# EAGLE design W501X (EAGLE 6.6.0)
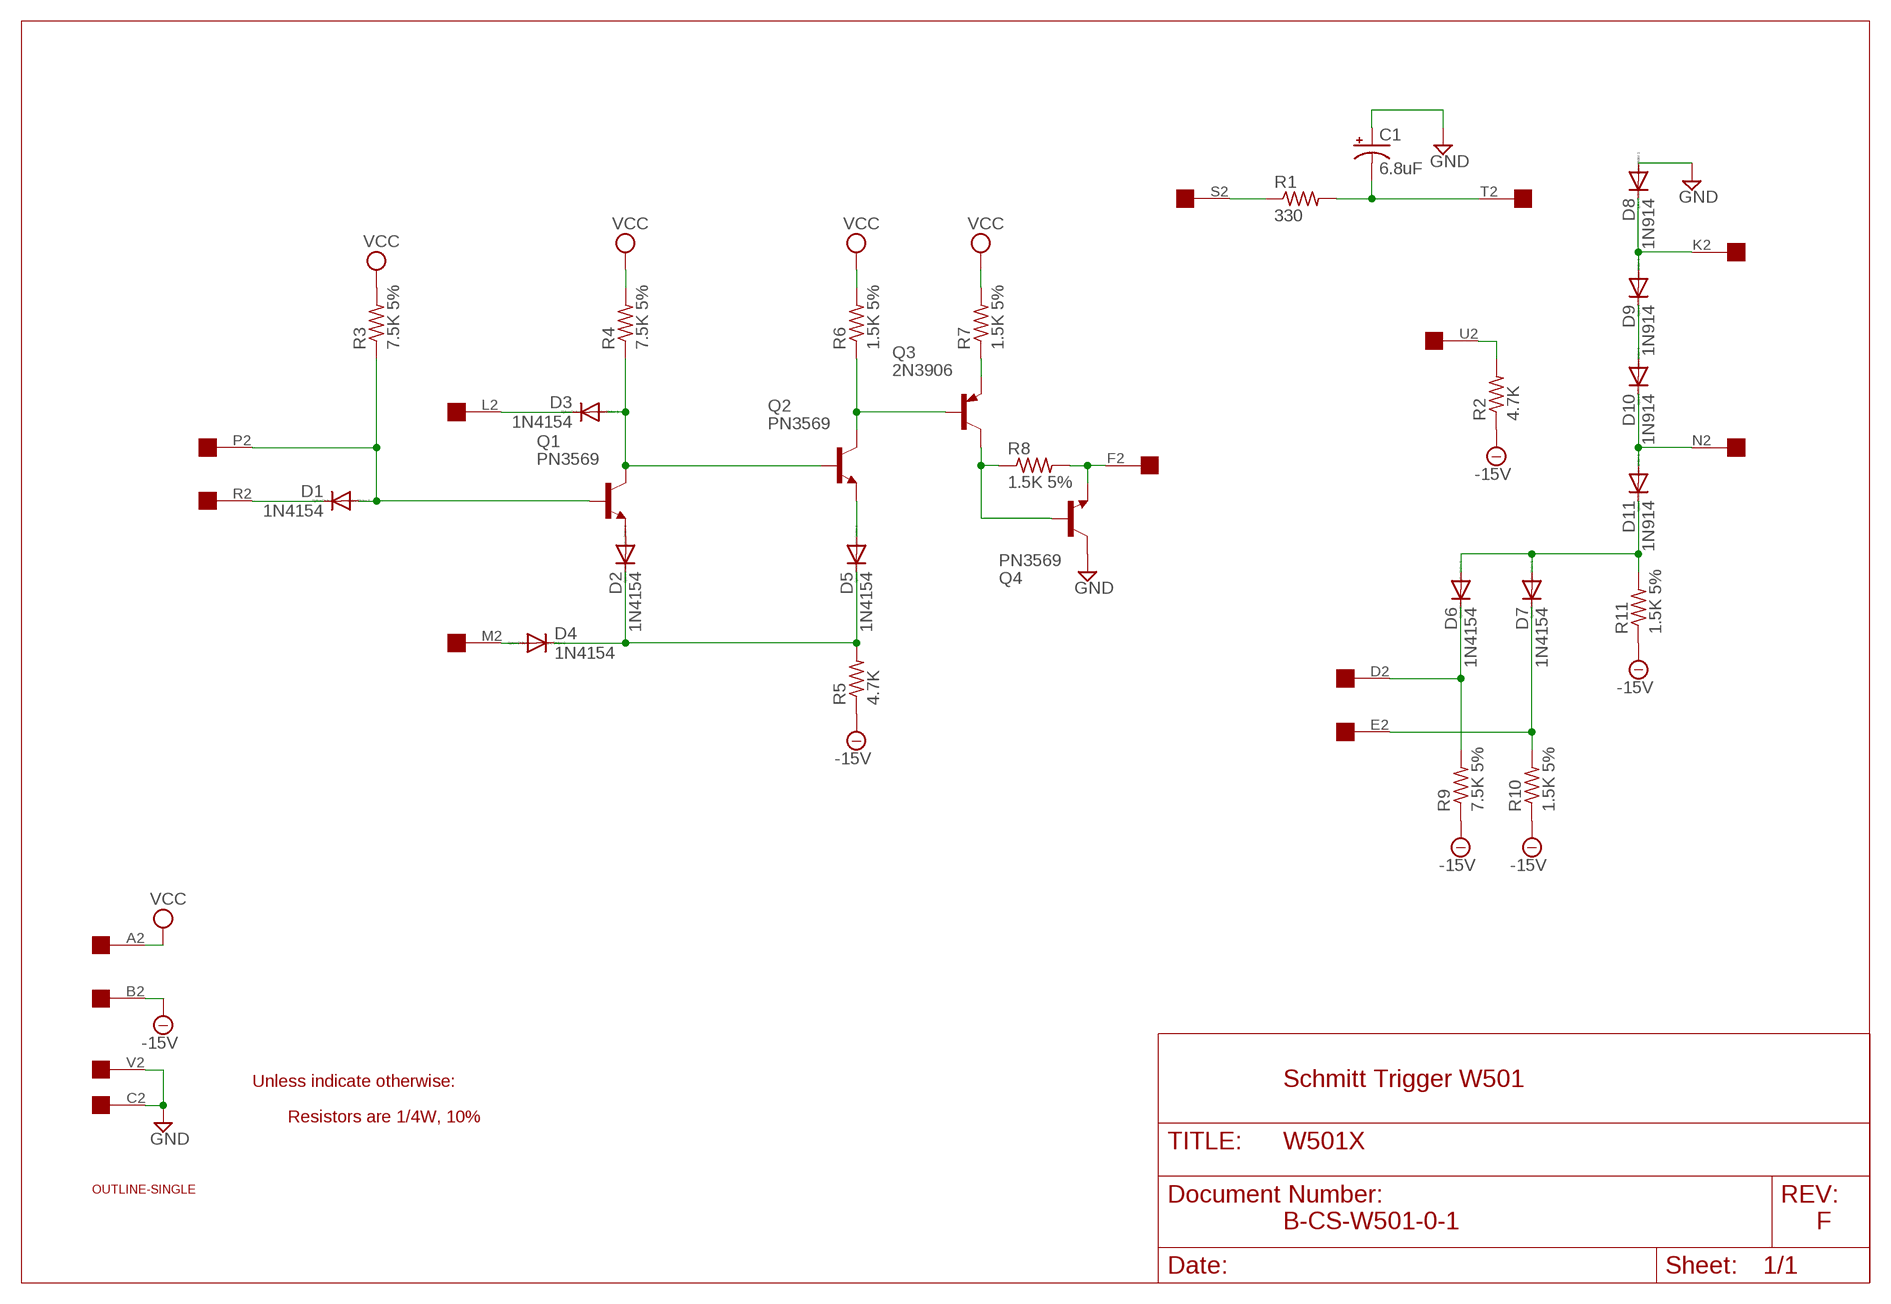
[diagram p0: schematic, sheet 1]

## Parts
C1  6.8uF  CPOL-USE15-5AXIAL  [E15-5]
D1  1N4154  1N4148DO35-10  [DO35-10]
D2  1N4154  1N4148DO35-10  [DO35-10]
D3  1N4154  1N4148DO35-10  [DO35-10]
D4  1N4154  1N4148DO35-10  [DO35-10]
D5  1N4154  1N4148DO35-10  [DO35-10]
D6  1N4154  1N4148DO35-10  [DO35-10]
D7  1N4154  1N4148DO35-10  [DO35-10]
D8  1N914  1N4148DO35-10  [DO35-10]
D9  1N914  1N4148DO35-10  [DO35-10]
D10  1N914  1N4148DO35-10  [DO35-10]
D11  1N914  1N4148DO35-10  [DO35-10]
EDGE  EDGE-1  [EDGE-CON1]
Q1  PN3569  2N2102  [TO5]
Q2  PN3569  2N2102  [TO5]
Q3  2N3906  2N2904  [TO39]
Q4  PN3569  2N2102  [TO5]
R1  330  R-US_0207/10  [0207/10]
R2  4.7K  R-US_0207/10  [0207/10]
R3  7.5K 5%  R-US_0207/10  [0207/10]
R4  7.5K 5%  R-US_0207/10  [0207/10]
R5  4.7K  R-US_0207/10  [0207/10]
R6  1.5K 5%  R-US_0207/10  [0207/10]
R7  1.5K 5%  R-US_0207/10  [0207/10]
R8  1.5K 5%  R-US_0207/10  [0207/10]
R9  7.5K 5%  R-US_0207/10  [0207/10]
R10  1.5K 5%  R-US_0207/10  [0207/10]
R11  1.5K 5%  R-US_0207/10  [0207/10]
U$1  OUTLINE-SINGLE  [SINGLE]

## Nets
-15V [Supply]: EDGE.B2 R2.1 R5.1 R9.1 R10.1 R11.1
GND [Supply]: C1.+ D8.A EDGE.C2 EDGE.V2 Q4.3(C)
N$1: Q3.1(E) R7.1
N$2: C1.- EDGE.T2 R1.2
N$3: EDGE.S2 R1.1
N$4: D8.C D9.A EDGE.K2
N$5: D9.C D10.A
N$6: D10.C D11.A EDGE.N2
N$7: D6.A D7.A D11.C R11.2
N$8: D6.C EDGE.D2 R9.2
N$9: D7.C EDGE.E2 R10.2
N$10: EDGE.U2 R2.2
N$11: EDGE.F2 Q4.1(E) R8.2
N$12: Q3.3(C) Q4.2(B) R8.1
N$13: Q2.3(C) Q3.2(B) R6.1
N$14: D5.A Q2.1(E)
N$15: D2.C D4.C D5.C R5.2
N$16: D2.A Q1.1(E)
N$17: D3.A Q1.3(C) Q2.2(B) R4.1
N$18: D3.C EDGE.L2
N$19: D4.A EDGE.M2
N$20: D1.A EDGE.P2 Q1.2(B) R3.1
N$21: D1.C EDGE.R2
VCC [Supply]: EDGE.A2 R3.2 R4.2 R6.2 R7.2
Unconnected: EDGE.H2 EDGE.J2

## Notes on the sheet
- Unless indicate otherwise: | Schmitt Trigger W501
- Resistors are 1/4W, 10%
- B-CS-W501-0-1 | F

## Library data of the parts
C1 = rcl:CPOL-US: POLARIZED CAPACITOR, American symbol
D1-D11 = diode:1N4148: DIODE high speed (Philips)
EDGE = dec-con:EDGE-1: Single-Sided DEC Edge Connector -- (side 2)
Q1 Q2 Q4 = transistor-npn:2N2102: NPN Transistor
Q3 = transistor-pnp:2N2904*: PNP Transistror
R1-R11 = rcl:R-US_: RESISTOR, American symbol
U$1 = dec-con:OUTLINE-*: Board outlines for DEC boards.

## Net classes
1 Supply: width 0.813 mm

## Board
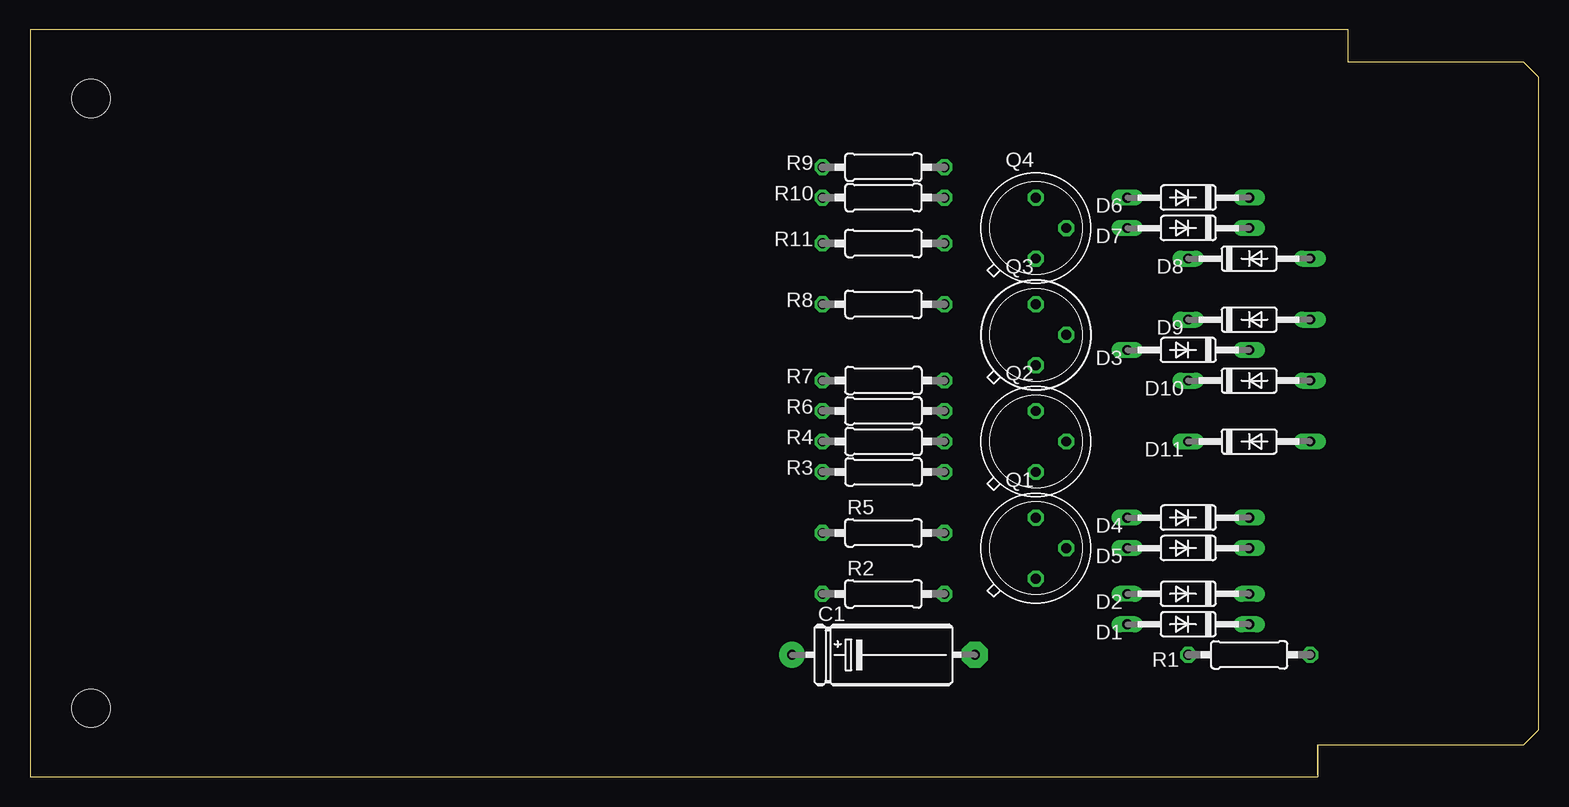
[diagram p1: board, top side]
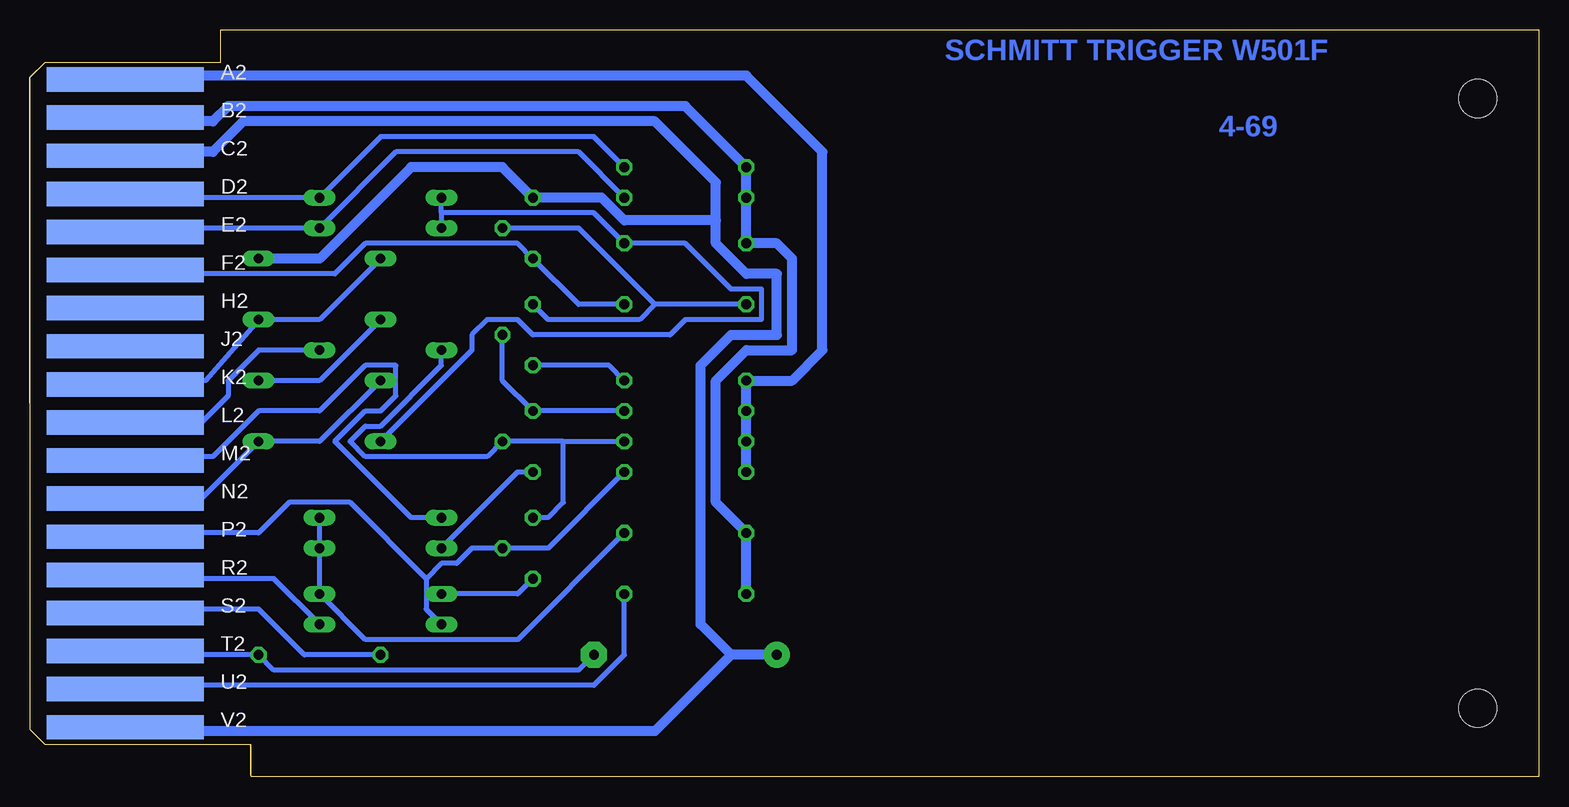
[diagram p2: board, bottom side, seen from below]

Size 125.73 x 62.23 mm. Coordinates in mm from the lower left corner, seen from the top.
Copper layers (1+16): Top 0.035mm / dielectric 1.5mm / Bottom 0.035mm
Design rules "16mils": minimum track width 16mil, minimum drill 32mil, track to track 15mil, track to pad 10mil, pad to pad 10mil, via to via 10mil, smd to smd 10mil, copper to edge 13mil, drill to drill 10mil, minimum pad ring 10mil, minimum via ring 8mil, stop-mask expansion 0mil, vias tented up to drill 0mil, thermal gap 10mil

### Footprints (pad centres in the part's own frame; a part is rotated, then mirrored left to right if it is on the bottom)
E15-5 = drill 0.813 pad 2.159: + -7.62,0 | drill 0.813 pad 2.159 octagon: - 7.62,0
DO35-10 = drill 0.813 long: A 5.08,0; C -5.08,0
EDGE-CON1 = smd 13.106 x 2.032 bottom: A2 7.938,4.128; B2 7.938,7.303; C2 7.938,10.477; D2 7.938,13.652; E2 7.938,16.828; F2 7.938,20.003; H2 7.938,23.177; J2 7.938,26.352; K2 7.938,29.527; L2 7.938,32.703; M2 7.938,35.877; N2 7.938,39.053; P2 7.938,42.227; R2 7.938,45.403; S2 7.938,48.578; T2 7.938,51.752; U2 7.938,54.928; V2 7.938,58.102
TO5 = drill 0.813 octagon: 1 0,-2.54; 2 2.54,0; 3 0,2.54
TO39 = drill 0.813 octagon: 1 0,-2.54; 2 2.54,0; 3 0,2.54
0207/10 = drill 0.813 octagon: 1 -5.08,0; 2 5.08,0
SINGLE = hole 3.175: 120.65,56.515; 120.65,5.715

### Placement (x,y rotation side)
C1  71.12,10.16 0 top
D1  96.52,12.7 180 top
D2  96.52,15.24 180 top
D3  96.52,35.56 180 top
D4  96.52,21.59 180 top
D5  96.52,19.05 180 top
D6  96.52,48.26 180 top
D7  96.52,45.72 180 top
D8  101.6,43.18 0 top
D9  101.6,38.1 0 top
D10  101.6,33.02 0 top
D11  101.6,27.94 0 top
EDGE  125.73,62.23 180 top
Q1  83.82,19.05 0 top
Q2  83.82,27.94 0 top
Q3  83.82,36.83 0 top
Q4  83.82,45.72 0 top
R1  101.6,10.16 0 top
R2  71.12,15.24 0 top
R3  71.12,25.4 180 top
R4  71.12,27.94 180 top
R5  71.12,20.32 0 top
R6  71.12,30.48 180 top
R7  71.12,33.02 180 top
R8  71.12,39.37 0 top
R9  71.12,50.8 0 top
R10  71.12,48.26 0 top
R11  71.12,44.45 0 top
U$1  125.73,62.23 180 top

### Tracks (layer width: path | path; a pad name or v marks a point on that pad's centre or on a via)
-15V
  Bottom 0.813: EDGE.B2 117.13,54.9 116.84,54.61 110.49,54.61 109.22,55.88 71.12,55.88 R9.1 R10.1 R11.1 63.5,44.45 62.23,43.18 62.23,35.56 66.04,35.56 68.58,33.02 68.58,22.86 R5.1 R2.1
GND
  Bottom 0.813: EDGE.C2 117.17,51.74 116.84,52.07 110.49,52.07 107.95,54.61 73.66,54.61 68.58,49.53 68.58,46.35 | 68.58,46.35 68.58,44.45 66.04,41.91 63.5,41.91 63.5,36.83 67.31,36.83 69.85,34.29 69.85,12.7 67.31,10.16 | 68.58,46.35 76.2,46.35 78.11,48.26 Q4.3 86.36,50.8 93.98,50.8 101.6,43.18 D8.A | C1.+ 67.31,10.16 | EDGE.V2 117.16,4.13 116.84,3.81 73.66,3.81 67.31,10.16
N$1
  Bottom 0.406: R7.1 77.47,34.29 Q3.1
N$2
  Bottom 0.406: C1.- 80.01,8.89 105.41,8.89 R1.2 116.84,10.16 117.17,10.49 EDGE.T2
N$3
  Bottom 0.406: EDGE.S2 115.88,13.66 115.57,13.97 106.68,13.97 102.87,10.16 R1.1
N$4
  Bottom 0.406: D8.C 101.6,38.1 D9.A 111.12,33.02 116.84,33.02 117.14,32.72 EDGE.K2
N$5
  Bottom 0.406: D9.C 101.6,33.02 D10.A
N$6
  Bottom 0.406: D10.C 101.6,27.94 D11.A 111.76,22.86 116.84,22.86 117.17,23.19 EDGE.N2
N$7
  Bottom 0.406: 91.44,46.99 D7.A | 91.44,46.99 D6.A | 91.44,46.99 78.74,46.99 R11.2 71.12,44.45 67.31,40.64 64.77,40.64 64.77,38.1 71.12,38.1 72.39,36.83 83.82,36.83 85.09,38.1 87.63,38.1 88.9,36.83 88.9,35.56 D11.C
N$8
  Bottom 0.406: R9.2 78.74,53.34 96.52,53.34 D6.C 116.84,48.26 117.14,48.56 EDGE.D2
N$9
  Bottom 0.406: EDGE.E2 117.17,45.39 116.84,45.72 D7.C 95.25,52.07 80.01,52.07 R10.2
N$10
  Bottom 0.406: EDGE.U2 117.2,7.26 116.84,7.62 78.74,7.62 76.2,10.16 R2.2
N$11
  Bottom 0.406: R8.2 80.01,39.37 Q4.1 85.09,44.45 97.79,44.45 100.33,41.91 116.84,41.91 117.12,42.19 EDGE.F2
N$12
  Bottom 0.406: Q4.2 80.01,45.72 73.66,39.37 | R8.1 73.66,39.37 | Q3.3 82.55,38.1 74.93,38.1 73.66,39.37
N$13
  Bottom 0.406: R6.1 Q2.3 86.36,33.02 Q3.2
N$14
  Bottom 0.406: Q2.1 85.09,25.4 D5.A
N$15
  Bottom 0.406: R5.2 85.09,11.43 97.79,11.43 D2.C D5.C D4.C
N$16
  Bottom 0.406: Q1.1 85.09,15.24 D2.A
N$17
  Bottom 0.406: 81.28,27.94 R4.1 | 81.28,27.94 Q2.2 87.63,26.67 97.79,26.67 99.06,27.94 97.79,29.21 96.52,29.21 91.44,34.29 D3.A | Q1.3 82.55,21.59 81.28,22.86 81.28,27.94
N$18
  Bottom 0.406: EDGE.L2 117.17,29.54 116.84,29.21 111.76,29.21 109.22,31.75 109.22,33.02 106.68,35.56 D3.C
N$19
  Bottom 0.406: EDGE.M2 117.17,26.34 116.84,26.67 110.49,26.67 106.68,30.48 101.6,30.48 97.79,34.29 95.25,34.29 95.25,31.75 96.52,30.48 97.79,30.48 100.33,27.94 93.98,21.59 D4.A
N$20
  Bottom 0.406: R3.1 82.55,19.05 Q1.2 88.9,19.05 90.17,17.78 91.44,17.78 92.71,16.51 | 92.71,16.51 92.71,13.97 D1.A | EDGE.P2 117.17,19.99 116.84,20.32 106.68,20.32 104.14,22.86 99.06,22.86 92.71,16.51
N$21
  Bottom 0.406: EDGE.R2 117.17,16.84 116.84,16.51 105.41,16.51 D1.C
VCC
  Bottom 0.813: R3.2 R4.2 R6.2 R7.2 62.23,33.02 59.69,35.56 59.69,52.07 66.04,58.42 116.84,58.42 117.22,58.04 EDGE.A2

### Text on the board
Bottom: SCHMITT TRIGGER W501F | 4-69